# EAGLE schematic NST output read (EAGLE 9.4.1)
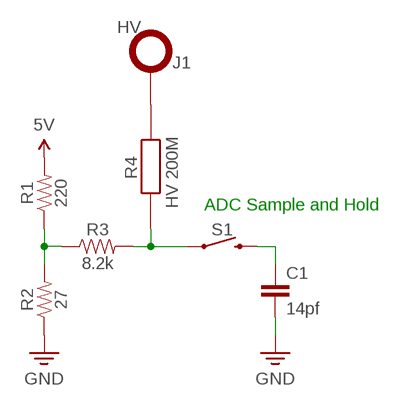
[diagram p0: schematic, sheet 1]

## Parts
C1  14pf  10NF-PTH-10MM-10000V-1-%  [CAP-PTH-10MM]
J1  HV  TERMINAL_M6  [LUG_SQUARE_M6]
R1  220  15KOHM-HORIZ-1/4W-5%  [AXIAL-0.3]
R2  27  15KOHM-HORIZ-1/4W-5%  [AXIAL-0.3]
R3  8.2k  15KOHM-HORIZ-1/4W-5%  [AXIAL-0.3]
R4  HV 200M  SM108031005FE  [SM108031007FE]
S1  MOMENTARY-SWITCH-SPST-PTH-6.0MM  [TACTILE_SWITCH_PTH_6.0MM]

## Nets
3.3V: C1.2 R2.P$1 ; supply symbol labelled GND
5V: R1.P$2
N$1: C1.1 S1.3
N$2: J1.P$1 R4.2
N$3: R1.P$1 R2.P$2 R3.P$1
N$4: R3.P$2 R4.1 S1.1

## Notes on the sheet
- ADC Sample and Hold

## Library data of the parts
C1 = SparkFun-Capacitors:10NF: 0.01uF/10nF/10,000pF ceramic capacitors A capacitor is a passive two-terminal electrical component used to store electrical energy temporarily in an electric field. CAP-09321; PROD_ID: CAP-09321; VALUE: 10nF
J1 = cwParts:TERMINAL_M6: Attachment for an M6 terminal
R1-R3 = SparkFun-Resistors:15KOHM: 15kΩ resistor A resistor is a passive two-terminal electrical component that implements electrical resistance as a circuit element. Resistors act to reduce current flow, and, at the same time, act to lower voltage levels within circuits. - Wikipedia; PROD_ID: RES-11360; VALUE: 15k
R4 = cwParts:SM108031005FE: Ohmite Slim Mox Series Planar Radial Thick Film Resistor 10M +/-1% 2.5W +/-25 ppm/C, +/-50 ppm/C Source: Datasheet <https://docs-emea.rs-online.com/webdocs/1489/0900766b8148969d.pdf>; DESCRIPTION: Ohmite Slim Mox Series Planar Radial Thick Film Resistor 10M +/-1% 2.5W +/-25 ppm/C, +/-50 ppm/C; HEIGHT: mm; MANUFACTURER_NAME: Ohmite; MANUFACTURER_PART_NUMBER: SM108031005FE; MOUSER_PART_NUMBER: N/A; MOUSER_PRICE-STOCK: https://www.mouser.com/Search/Refine.aspx?Keyword=N%2FA; RS_PART_NUMBER: 8927338; RS_PRICE-STOCK: http://uk.rs-online.com/web/p/products/8927338
S1 = SparkFun-Switches:MOMENTARY-SWITCH-SPST: Momentary Switch (Pushbutton) - SPST Normally-open (NO) SPST momentary switches (buttons, pushbuttons). Variants PTH-12MM - 12mm square, through-hole Momentary Pushbutton Switch - 12mm Square <https://www.sparkfun.com/products/9190> (COM-09190) PTH-6.0MM, PTH-6.0MM-KIT - 6.0mm square, through-hole Mini Pushbutton Switch <https://www.sparkfun.com/products/97> (COM-00097) KIT package intended for soldering kit's - only one side of pads' copper is exposed. PTH-RIGHT-ANGLE-KIT - Right-angle, through-hole Right Angle Tactile Button <https://www.sparkfun.com/products/10791> - Used on SparkFun BigTime Watch Kit <https://www.sparkfun.com/products/11734> SMD-12MM - 12mm square, surface-mount Tactile Button - SMD (12mm) <https://www.sparkfun.com/products/12993> (COM-12993) Used on SparkFun PicoBoard <https://www.sparkfun.com/products/11888> SMD-4.5MM - 4.5mm Square Trackball Switch Used on SparkFun Blackberry Trackballer Breakout <https://www.sparkfun.com/products/13169> SMD-4.6MMX2.8MM - 4.60mm x 2.80mm, surface mount Used on SparkFun SAMD21 Mini Breakout <https://www.sparkfun.com/products/13664> SMD-5.2MM, SMD-5.2-REDUNDANT - 5.2mm square, surface-mount Mini Pushbutton Switch - SMD <https://www.sparkfun.com/products/8720> (COM-08720) Used on Arduino Pro Mini <https://www.sparkfun.com/products/11114> REDUNDANT package connects both switch circuits together SMD-6.0X3.5MM - 6.0 x 3.5mm, surface mount Momentary Reset Switch SMD <https://www.sparkfun.com/products/8229> (COM-08229) SMD-6.2MM-TALL - 6.2mm square, surface mount Tactile Button - SMD (6mm) <https://www.sparkfun.com/products/12992> Used on SparkFun Digital Sandbox <https://www.sparkfun.com/products/12651> SMD-RIGHT-ANGLE - Right-angle, surface mount Used on SparkFun Block for Intel® Edison - Arduino <https://www.sparkfun.com/products/13036>; PROD_ID: SWCH-08441; SF_SKU: COM-00097